# Altium schematic sheet PSU_BZX84C7V5_-7V5.SchDoc: PSU BZX84C7V5  -7V5
size A4; Organization: Altium Limited.; Address1: Level 3, 12a Rodborough Rd; Address2: Frenchs Forest 2086; Address3: NSW; Address4: AUSTRALIA; Revision: 6; SheetNumber: 35; SheetTotal: 64
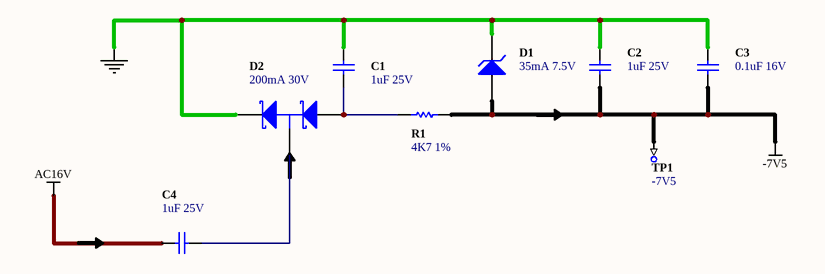
[diagram p0: PSU_BZX84C7V5_-7V5.SchDoc]

## Parts
C1  1uF 25V  [CAPC3216-STAR]
C2  1uF 25V  [CAPC3216-STAR]
C3  0.1uF 16V  [CAPC1005-STAR]
C4  1uF 25V  [CAPC3216-STAR]
D1  35mA 7.5V  [SOT95P230-3D]
D2  200mA 30V  [SOT95P230-3C]
R1  4K7 1%  [RESC1005-STAR]
TP1  -7V5  [TestPin]  (no BOM)

## Nets
-7V5: C2.1 C3.2 D1.1(A) R1.2 TP1.1
AC16V: C4.1
GND: C1.2 C2.2 C3.1 D1.2(K) D2.2(K)
NetC1_1: C1.1 D2.1(A) R1.1
NetC4_2: C4.2 D2.3(C)

## Notes on the sheet
- Sheet Title
- Project Title
- Size:
- Date:
- A4
- Assy:
- Time:
- Sheet
- Revision:
- of
- File:

## Library data of the parts
C1 C2 C4 = D-101-0027: Capacitor, Ceramic, 1uF 10% 25V 1206 (3216) X7R; Polarity: Non-Polarized; Category: Capacitor; Capacitance: 1 uF; Dielectric: X7R; Mounting Technology: Surface Mount; Rated Voltage: 25 V; Status: Production; Technology: Ceramic; Tolerance: 10 %
C3 = D-101-0080: Capacitor, Ceramic, 0.1uF 10% 16V 0402 (1005) X7R; Polarity: Non-Polarized; Category: Capacitor; Capacitance: 0.1 uF; Dielectric: X7R; Mounting Technology: Surface Mount; Rated Voltage: 16 V; Status: Production; Technology: Ceramic; Tolerance: 10 %
D1 = D-150-0002: Zener Diode, 7.5V 35mA; Category: Diode-Zener; Max Forward Current: 35 mA; Mounting Technology: Surface Mount; Rated Voltage: 7.5 V; Status: Production
D2 = D-151-0001: Schottky Diode, Dual-Serial, BAT54S 30V 200mA; Category: Diode-Schottky; Max Forward Current: 200 mA; Mounting Technology: Surface Mount; Rated Voltage: 30 V; Status: Production
R1 = D-100-0088: Resistor, 4K7 1% 0402 (1005); Power Rating: 63 mW; Resistance: 4.7 K; Category: Resistor; Mounting Technology: Surface Mount; Status: Production; Tolerance: 1 %
TP1 = D-006-0000: Test Point, PCB Mount with Silkscreen Box; Category: Test-Point; Status: Production